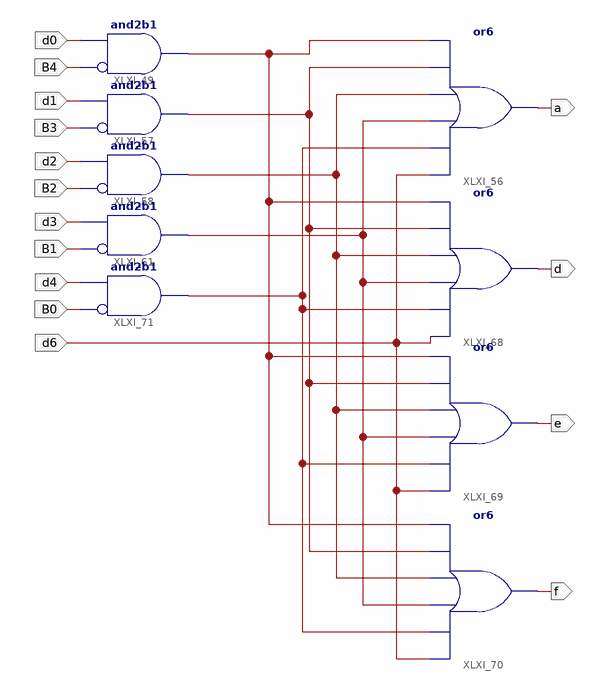
[diagram p0: schematic sheet 1]
// Xilinx ISE schematic adefSSD.sch (xc9500xl) as structural Verilog: 9 symbols, 15 ports
module adefSSD (
  input  B4,
  input  B3,
  input  B2,
  input  B1,
  input  B0,
  input  d3,
  input  d2,
  input  d1,
  input  d0,
  input  d6,
  input  d4,
  output a,
  output d,
  output e,
  output f
);

  wire XLXN_60, XLXN_65, XLXN_71, XLXN_76, XLXN_98;

  and XLXI_49 (XLXN_60, ~B4, d0);  // and2b1
  and XLXI_57 (XLXN_65, ~B3, d1);  // and2b1
  and XLXI_58 (XLXN_71, ~B2, d2);  // and2b1
  and XLXI_61 (XLXN_76, ~B1, d3);  // and2b1
  or XLXI_56 (a, d6, XLXN_98, XLXN_76, XLXN_71, XLXN_65, XLXN_60);
  or XLXI_68 (d, d6, XLXN_98, XLXN_76, XLXN_71, XLXN_65, XLXN_60);
  or XLXI_69 (e, d6, XLXN_98, XLXN_76, XLXN_71, XLXN_65, XLXN_60);
  or XLXI_70 (f, d6, XLXN_98, XLXN_76, XLXN_71, XLXN_65, XLXN_60);
  and XLXI_71 (XLXN_98, ~B0, d4);  // and2b1
endmodule
